# EAGLE board NN22_VCCS_SrcAdapter02_s00 (EAGLE 7.7.0)
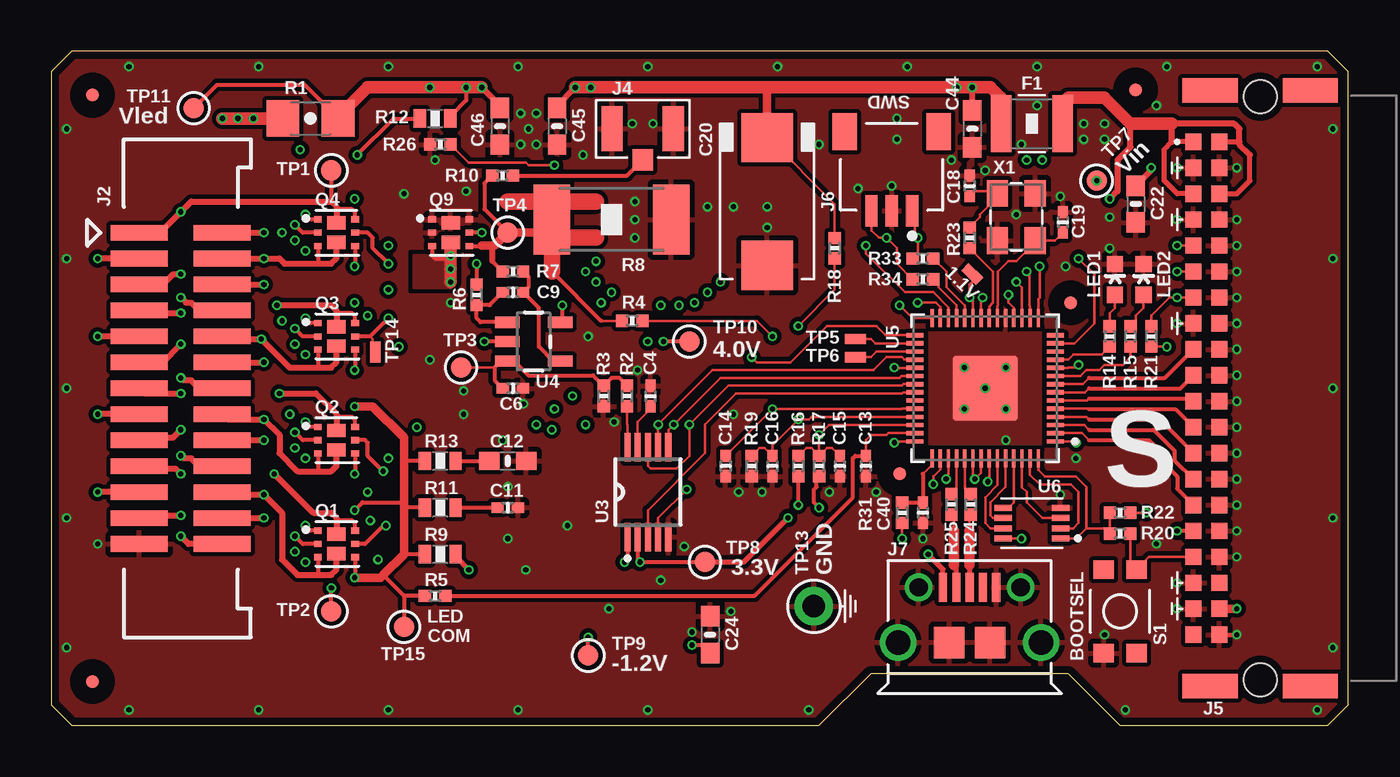
[diagram p4: board, top side]
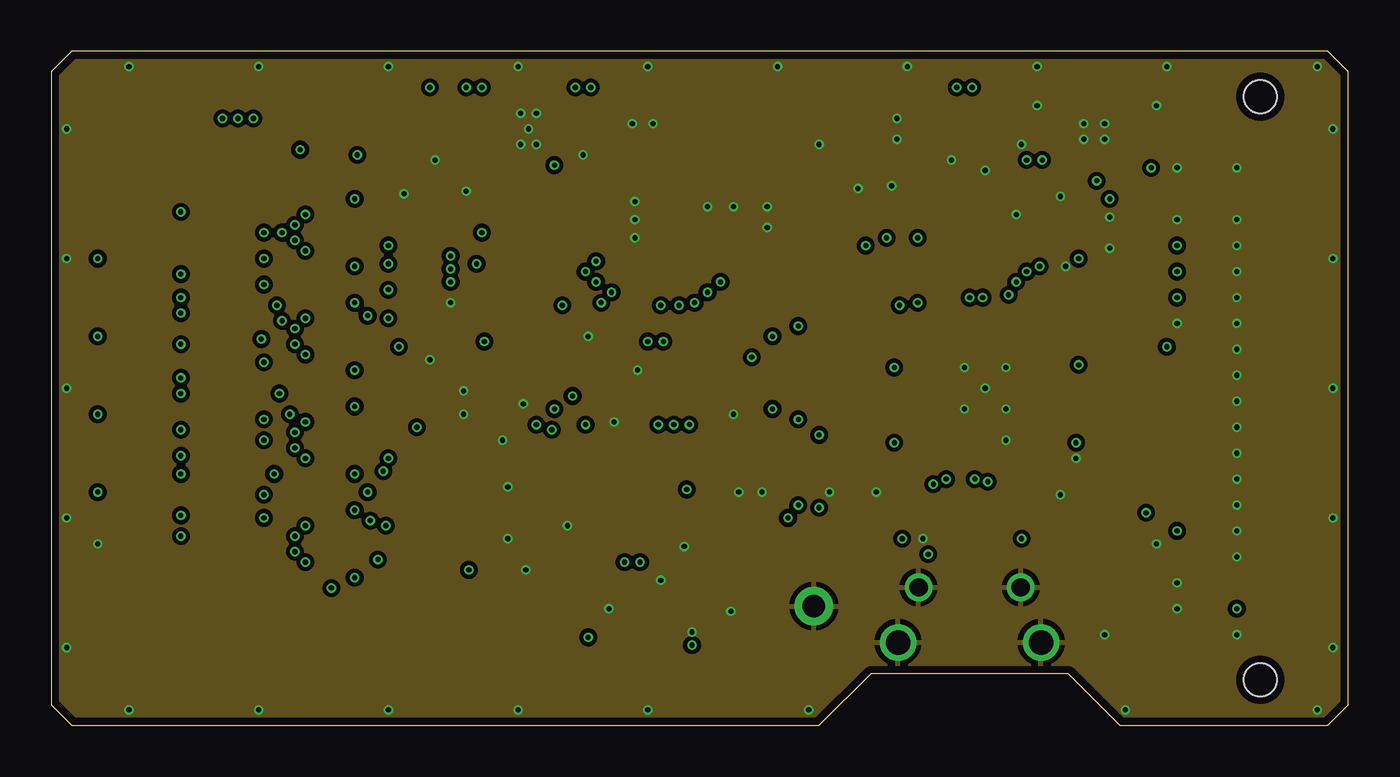
[diagram p5: board, inner layer Route2]
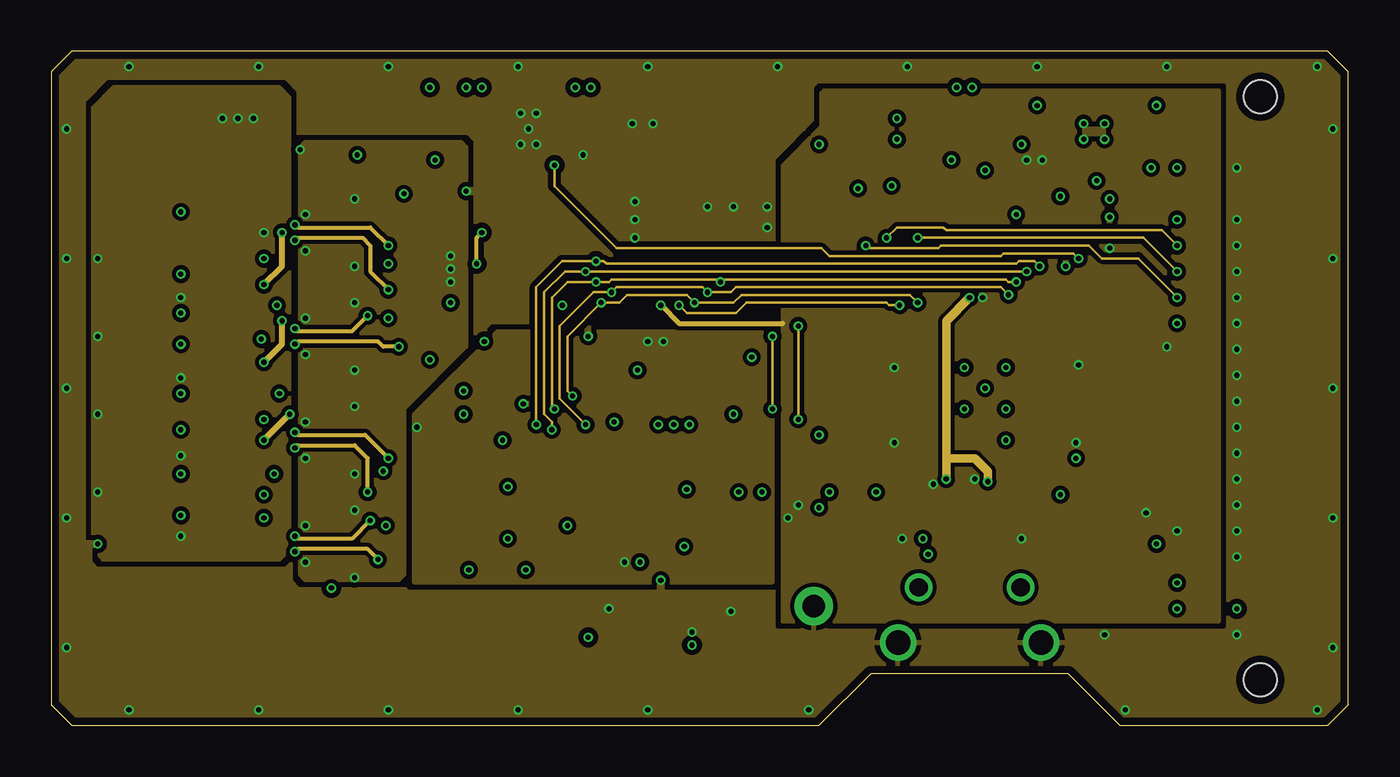
[diagram p6: board, inner layer Route15]
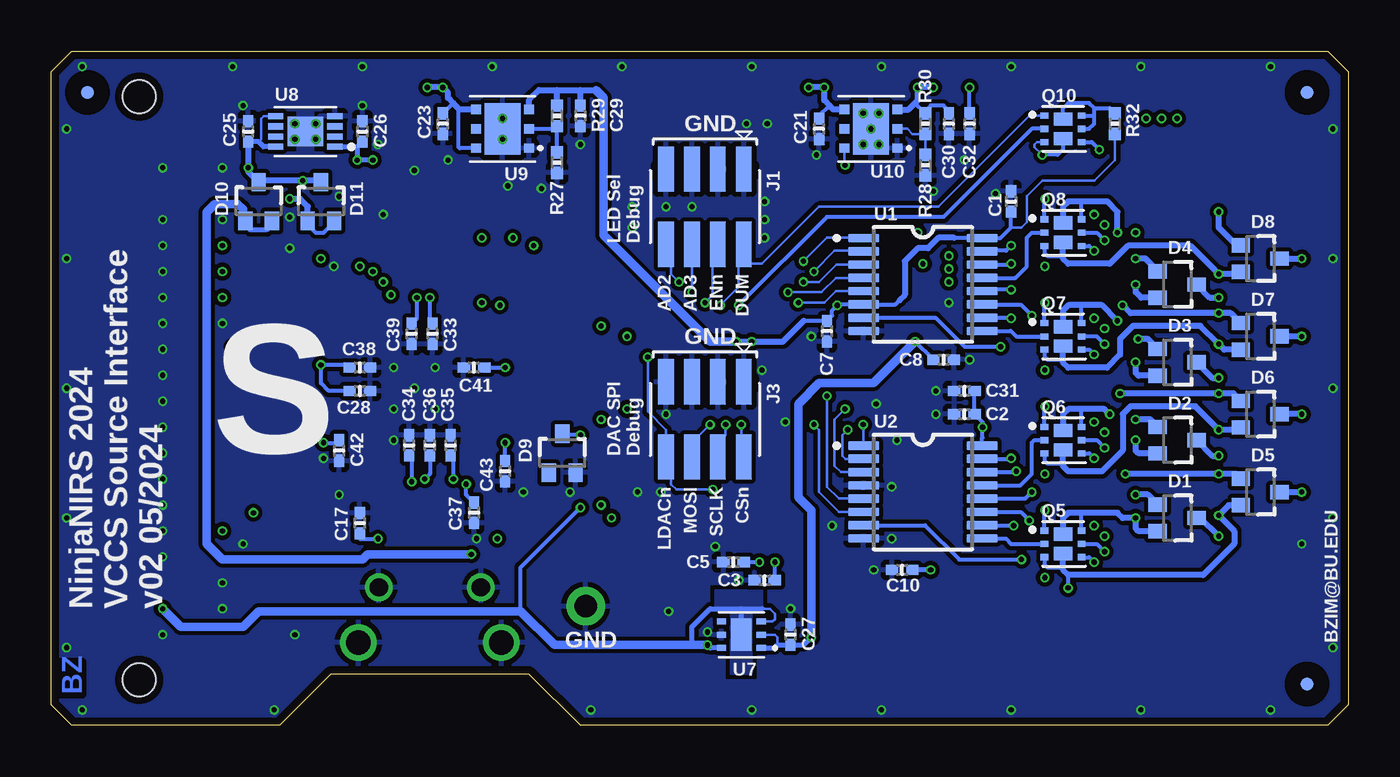
[diagram p7: board, bottom side, seen from below]

Size 63.5 x 33.02 mm. Coordinates in mm from the lower left corner, seen from the top.
Outline: 63.5,1.02 63.5,32 62.48,33.02 1.02,33.02 0,32 0,1.02 1.02,0 37.59,0 40.13,2.54 49.78,2.54 52.32,0 62.48,0 63.5,1.02
Copper layers (1*2*15*16): Top 0.035559375mm / dielectric 0.17018125mm / Route2 0.01778125mm / dielectric 47mil / Route15 0.01778125mm / dielectric 0.17018125mm / Bottom 0.035559375mm
Design rules "OSHPark-4layer *": minimum track width 5mil, minimum drill 10mil, track to track 5mil, track to pad 5mil, pad to pad 5mil, via to via 5mil, smd to smd 5mil, copper to edge 15mil, drill to drill 6mil, minimum pad ring 4mil, minimum via ring 4mil, stop-mask expansion 2mil, vias tented up to drill 12mil, thermal gap 10mil
tRestrict: area 57,24.1 to 57.3,24.2; area 57,22.8 to 57.3,22.9; area 57,21.6 to 57.3,21.6; area 57,20.3 to 57.3,20.3; area 57,19 to 57.3,19.1; area 57,17.8 to 57.3,17.8; area 57,16.5 to 57.3,16.5; area 57,15.2 to 57.3,15.3; area 57,13.9 to 57.3,14; area 57,12.7 to 57.3,12.7; area 57,11.4 to 57.3,11.5; area 57,10.1 to 57.3,10.2; 6 more areas; 1 lines
bRestrict: 9 lines

## Footprints (pad centres in the part's own frame; a part is rotated, then mirrored left to right if it is on the bottom)
0402-CAP = smd 0.6 x 0.5: 1 -0.5,0; 2 0.5,0
0603-CAP = smd 1 x 0.9: 1 -0.9,0; 2 0.9,0
2917-CAP = smd 2.4 x 2.5: N 3.125,0; P -3.125,0
SOT323 = smd 0.9 x 0.7: 1 -0.95,0.65; 2 -0.95,-0.65; 3 0.95,0
1210-FUSE = smd 1 x 2.8: 1 -1.5,0; 2 1.5,0
MICRO-FIDUCIAL = smd 0.635 x 0.635: 1 0,0
M04X2_0.050_SMD_NO_CREAM = smd 2.21 x 0.762: 1 -1.841,1.905; 2 1.841,1.905; 3 -1.841,0.635; 4 1.841,0.635; 5 -1.841,-0.635; 6 1.841,-0.635; 7 -1.841,-1.905; 8 1.841,-1.905
M13X2_0.050_SHF = smd 2.794 x 0.762: 1 -2.032,7.62; 2 2.032,7.62; 3 -2.032,6.35; 4 2.032,6.35; 5 -2.032,5.08; 6 2.032,5.08; 7 -2.032,3.81; 8 2.032,3.81; 9 -2.032,2.54; 10 2.032,2.54; 11 -2.032,1.27; 12 2.032,1.27; 13 -2.032,0; 14 2.032,0; 15 -2.032,-1.27; 16 2.032,-1.27; 17 -2.032,-2.54; 18 2.032,-2.54; 19 -2.032,-3.81; 20 2.032,-3.81; 21 -2.032,-5.08; 22 2.032,-5.08; 23 -2.032,-6.35; 24 2.032,-6.35; 25 -2.032,-7.62; 26 2.032,-7.62
U.FL = smd 2.2 x 1.05: P$1 0,1.5; P$2 0,-1.5 | smd 1.05 x 1: P$3 1.525,0
M20X2_HARFLEX_M = smd 0.8 x 0.8: A1 12.065,2; A2 10.795,2; A3 9.525,2; A4 8.255,2; A5 6.985,2; A6 5.715,2; A7 4.445,2; A8 3.175,2; A9 1.905,2; A10 0.635,2; A11 -0.635,2; A12 -1.905,2; A13 -3.175,2; A14 -4.445,2; A15 -5.715,2; A16 -6.985,2; A17 -8.255,2; A18 -9.525,2; A19 -10.795,2; A20 -12.065,2; B1 12.065,3.27; B2 10.795,3.27; B3 9.525,3.27; B4 8.255,3.27; B5 6.985,3.27; B6 5.715,3.27; B7 4.445,3.27; B8 3.175,3.27; B9 1.905,3.27; B10 0.635,3.27; B11 -0.635,3.27; B12 -1.905,3.27; B13 -3.175,3.27; B14 -4.445,3.27; B15 -5.715,3.27; B16 -6.985,3.27; B17 -8.255,3.27; B18 -9.525,3.27; B19 -10.795,3.27; B20 -12.065,3.27 | smd 1.2 x 2.7: P$17 -14.575,2.45; P$18 -14.575,-2.45; P$19 14.575,2.45; P$20 14.575,-2.45 | hole 1.6: -14.275,0; 14.275,0
M03X1_JST_SH_SM_RA = smd 0.6 x 1.55: 1 -1,4.775; 2 0,4.775; 3 1,4.775 | smd 1.2 x 1.8: PAD1 -2.3,0.9; PAD2 2.3,0.9
USB-MICRO = smd 0.4 x 1.4: 1 -1.3,2.7; 2 -0.65,2.7; 3 0,2.7; 4 0.65,2.7; 5 1.3,2.7 | drill 0.9: SH1 -2.5,2.7; SH2 2.5,2.7 | drill 1.2: SH3 -3.5,0; SH6 3.5,0 | smd 1.5 x 1.55: SH4 -1,0; SH5 1,0
LED-0603 = smd 0.8 x 0.8: A 0,-0.75; C 0,0.75
UDFN8 = smd 0.375 x 0.3: 1 -0.91,0.65; 2 -0.91,0; 3 -0.91,-0.65; 4 0.91,-0.65; 5 0.91,0; 6 0.91,0.65 | smd 0.9 x 0.65: P1 0,0.475; P2 0,-0.475
1206 = smd 1.6 x 1.8: 1 -1.35,0; 2 1.35,0
0402-RES = smd 0.6 x 0.6: 1 -0.5,0; 2 0.5,0
R2512 = smd 1.778 x 3.429: 1 -2.921,0; 2 2.921,0
0603-RES = smd 0.6 x 0.9: 1 -0.75,0; 2 0.75,0
TACTILE_SWITCH_SMD-3 = smd 0.9 x 1: 1 -2.05,0.8; 2 2.05,0.8; 3 -2.05,-0.8; 4 2.05,-0.8
TESTPAD_ROUND = smd 1.016 x 1.016: P$1 0,0
TESTPAD_SMALL = smd 1.016 x 0.508: P$1 0,0
1X01 = drill 1.1 pad 1.88: 1 0,0
TSSOP16 = smd 1.5 x 0.42: 1 -2.9,2.275; 2 -2.9,1.625; 3 -2.9,0.975; 4 -2.9,0.325; 5 -2.9,-0.325; 6 -2.9,-0.975; 7 -2.9,-1.625; 8 -2.9,-2.275; 9 2.9,-2.275; 10 2.9,-1.625; 11 2.9,-0.975; 12 2.9,-0.325; 13 2.9,0.325; 14 2.9,0.975; 15 2.9,1.625; 16 2.9,2.275
MSOP10 = smd 1.4 x 0.3: 1 -2.2,1; 2 -2.2,0.5; 3 -2.2,0; 4 -2.2,-0.5; 5 -2.2,-1; 6 2.2,-1; 7 2.2,-0.5; 8 2.2,0; 9 2.2,0.5; 10 2.2,1
SOT23-5 = smd 1.2 x 0.55: 1 -1.3,0.95; 2 -1.3,0; 3 -1.3,-0.95; 4 1.3,-0.95; 5 1.3,0.95
QFN-56_EP = smd 0.875 x 0.2: 1 -3.438,2.6; 2 -3.438,2.2; 3 -3.438,1.8; 4 -3.438,1.4; 5 -3.438,1; 6 -3.438,0.6; 7 -3.438,0.2; 8 -3.438,-0.2; 9 -3.438,-0.6; 10 -3.438,-1; 11 -3.438,-1.4; 12 -3.438,-1.8; 13 -3.438,-2.2; 14 -3.438,-2.6; 29 3.438,-2.6; 30 3.438,-2.2; 31 3.438,-1.8; 32 3.438,-1.4; 33 3.438,-1; 34 3.438,-0.6; 35 3.438,-0.2; 36 3.438,0.2; 37 3.438,0.6; 38 3.438,1; 39 3.438,1.4; 40 3.438,1.8; 41 3.438,2.2; 42 3.438,2.6 | smd 0.2 x 0.875: 15 -2.6,-3.438; 16 -2.2,-3.438; 17 -1.8,-3.438; 18 -1.4,-3.438; 19 -1,-3.438; 20 -0.6,-3.438; 21 -0.2,-3.438; 22 0.2,-3.438; 23 0.6,-3.438; 24 1,-3.438; 25 1.4,-3.438; 26 1.8,-3.438; 27 2.2,-3.438; 28 2.6,-3.438; 43 2.6,3.438; 44 2.2,3.438; 45 1.8,3.438; 46 1.4,3.438; 47 1,3.438; 48 0.6,3.438; 49 0.2,3.438; 50 -0.2,3.438; 51 -0.6,3.438; 52 -1,3.438; 53 -1.4,3.438; 54 -1.8,3.438; 55 -2.2,3.438; 56 -2.6,3.438 | smd 3.2 x 3.2: PAD 0,0
USON8L-2X3MM = smd 0.85 x 0.3: 1 -1.4,0.75; 2 -1.4,0.25; 3 -1.4,-0.25; 4 -1.4,-0.75; 5 1.4,-0.75; 6 1.4,-0.25; 7 1.4,0.25; 8 1.4,0.75
WSON6 = smd 0.45 x 0.3: 1 -0.975,0.65; 2 -0.975,0; 3 -0.975,-0.65; 4 0.975,-0.65; 5 0.975,0; 6 0.975,0.65 | smd 1 x 1.6: PAD 0,0
DFN8_2X3MM = smd 0.75 x 0.3: 1 -1.45,0.75; 2 -1.45,0.25; 3 -1.45,-0.25; 4 -1.45,-0.75; 5 1.45,-0.75; 6 1.45,-0.25; 7 1.45,0.25; 8 1.45,0.75 | smd 1.75 x 1.45: P 0,0
DFN6_3X3MM = smd 0.5 x 0.45: 1 -1.3,0.95; 2 -1.3,0; 3 -1.3,-0.95; 4 1.3,-0.95; 5 1.3,0; 6 1.3,0.95 | smd 1.75 x 2.5: PAD 0,0
CRYSTAL-3.2-2.5 = smd 1.3 x 1.05: 1 -1.15,-0.925; 2 1.15,-0.925; 3 1.15,0.925; 4 -1.15,0.925

## Placement (x,y rotation side)
C1  0.1u  [0402-CAP]  16.51,25.65 90 bottom
C2  0.1u  [0402-CAP]  18.8,15.24 180 bottom
C3  0.1u  [0402-CAP]  28.57,7.11 180 bottom
C4  10n  [0402-CAP]  29.34,16.13 90 top
C5  0.1u  [0402-CAP]  30.1,8 180 bottom
C6  100p  [0402-CAP]  22.61,16.51 0 top
C7  0.1u  [0402-CAP]  25.53,19.3 270 bottom
C8  0.1u  [0402-CAP]  19.81,17.91 0 bottom
C9  100p  [0402-CAP]  22.61,21.21 0 top
C10  0.1u  [0402-CAP]  21.84,7.62 180 bottom
C11  10n  [0402-CAP]  22.35,10.67 0 top
C12  DNP  [0603-CAP]  22.35,12.95 0 top
C13  100p  [0402-CAP]  39.88,12.7 270 top
C14  100p  [0402-CAP]  33.02,12.7 270 top
C15  100p  [0402-CAP]  38.61,12.7 270 top
C16  100p  [0402-CAP]  35.31,12.7 270 top
C17  0.1u  [0402-CAP]  48.39,9.91 90 bottom
C18  27p  [0402-CAP]  44.96,26.42 90 top
C19  27p  [0402-CAP]  49.53,24.64 90 top
C20  150u  [2917-CAP]  35.05,25.65 270 top
C21  0.1u  [0402-CAP]  25.91,29.21 270 bottom
C22  10u  [0603-CAP]  53.09,25.53 270 top
C23  0.1u  [0402-CAP]  44.32,29.46 270 bottom
C24  10u  [0603-CAP]  32.26,4.45 270 top
C25  0.1u  [0402-CAP]  53.85,29.08 90 bottom
C26  4.7u  [0402-CAP]  48.26,29.08 90 bottom
C27  4.7u  [0402-CAP]  27.3,4.45 270 bottom
C28  4.7u  [0402-CAP]  48.39,16.38 0 bottom
C29  4.7u  [0402-CAP]  37.59,29.84 270 bottom
C30  0.1u  [0402-CAP]  19.56,29.46 270 bottom
C31  4.7u  [0402-CAP]  18.8,16.38 180 bottom
C32  DNP  [0402-CAP]  18.54,29.46 270 bottom
C33  0.1u  [0402-CAP]  44.83,19.18 270 bottom
C34  0.1u  [0402-CAP]  45.97,13.72 90 bottom
C35  4.7u  [0402-CAP]  43.94,13.72 90 bottom
C36  0.1u  [0402-CAP]  44.96,13.72 90 bottom
C37  4.7u  [0402-CAP]  42.8,10.41 270 bottom
C38  0.1u  [0402-CAP]  48.39,17.53 0 bottom
C39  0.1u  [0402-CAP]  45.85,19.18 270 bottom
C40  4.7u  [0402-CAP]  42.67,10.41 270 top
C41  0.1u  [0402-CAP]  42.8,17.53 180 bottom
C42  0.1u  [0402-CAP]  49.4,13.46 270 bottom
C43  0.1u  [0402-CAP]  41.27,12.45 270 bottom
C44  10u  [0603-CAP]  45.09,29.21 270 top
C45  10u  [0603-CAP]  24.77,29.34 270 top
C46  10u  [0603-CAP]  21.97,29.34 270 top
D1  BAV70W  [SOT323]  8.38,10.16 0 bottom
D2  BAV70W  [SOT323]  8.38,13.97 0 bottom
D3  BAV70W  [SOT323]  8.38,17.78 0 bottom
D4  BAV70W  [SOT323]  8.38,21.59 0 bottom
D5  BAV70W  [SOT323]  4.32,11.43 0 bottom
D6  BAV70W  [SOT323]  4.32,15.24 0 bottom
D7  BAV70W  [SOT323]  4.32,19.05 0 bottom
D8  BAV70W  [SOT323]  4.32,22.86 0 bottom
D9  BAV70W  [SOT323]  38.48,13.34 90 bottom
D10  BAV70W  [SOT323]  53.34,25.65 90 bottom
D11  BAV70W  [SOT323]  50.29,25.65 90 bottom
F1  0ZCH0035FF2G  [1210-FUSE]  48.01,29.46 0 top
FID1  FIDUCIALUFIDUCIAL  [MICRO-FIDUCIAL]  2.03,30.86 0 top
FID2  FIDUCIALUFIDUCIAL  [MICRO-FIDUCIAL]  49.91,20.7 0 top
FID3  FIDUCIALUFIDUCIAL  [MICRO-FIDUCIAL]  2.03,2.16 0 top
FID4  FIDUCIALUFIDUCIAL  [MICRO-FIDUCIAL]  41.53,12.32 0 top
FID5  FIDUCIALUFIDUCIAL  [MICRO-FIDUCIAL]  53.09,31.11 0 top
FID6  FIDUCIALUFIDUCIAL  [MICRO-FIDUCIAL]  2.03,30.99 0 bottom
FID7  FIDUCIALUFIDUCIAL  [MICRO-FIDUCIAL]  2.03,2.03 0 bottom
FID8  FIDUCIALUFIDUCIAL  [MICRO-FIDUCIAL]  61.72,30.99 0 bottom
J1  M04X2_0.050_SMD_NO_CREAM  [M04X2_0.050_SMD_NO_CREAM]  31.5,25.4 270 bottom
J2  M13X2_0.050_SHF  [M13X2_0.050_SHF]  6.35,16.51 0 top
J3  M04X2_0.050_SMD_NO_CREAM  [M04X2_0.050_SMD_NO_CREAM]  31.5,14.99 270 bottom
J4  U.FL  [U.FL]  28.96,29.21 270 top
J5  M20X2_HARFLEX_M  [M20X2_HARFLEX_M]  59.18,16.51 90 top
J6  M03X1_JST_SH_RA  [M03X1_JST_SH_SM_RA]  41.15,29.97 180 top
J7  USB-MICRO  [USB-MICRO]  44.96,4.06 0 top
LED1  [LED-0603]  52.07,21.84 0 top
LED2  [LED-0603]  53.47,21.84 0 top
Q1  MOSFET-DUAL-N-UDFN8  [UDFN8]  13.97,8.89 0 top
Q2  MOSFET-DUAL-N-UDFN8  [UDFN8]  13.97,13.97 0 top
Q3  MOSFET-DUAL-N-UDFN8  [UDFN8]  13.97,19.05 0 top
Q4  MOSFET-DUAL-N-UDFN8  [UDFN8]  13.97,24.13 0 top
Q5  MOSFET-DUAL-N-UDFN8  [UDFN8]  13.97,8.89 0 bottom
Q6  MOSFET-DUAL-N-UDFN8  [UDFN8]  13.97,13.97 0 bottom
Q7  MOSFET-DUAL-N-UDFN8  [UDFN8]  13.97,19.05 0 bottom
Q8  MOSFET-DUAL-N-UDFN8  [UDFN8]  13.97,24.13 0 bottom
Q9  MOSFET-DUAL-N-UDFN8  [UDFN8]  19.56,24.13 0 top
Q10  MOSFET-DUAL-N-UDFN8  [UDFN8]  13.97,29.21 0 bottom
R1  0  [1206]  12.7,29.72 0 top
R2  10k  [0402-RES]  28.19,16.13 90 top
R3  24k  [0402-RES]  27.05,16.13 90 top
R4  10k  [0402-RES]  28.45,19.81 180 top
R5  10k  [0402-RES]  18.8,6.35 180 top
R6  100  [0402-RES]  20.83,21.08 90 top
R7  1.2k  [0402-RES]  22.61,22.23 180 top
R8  8.2  [R2512]  27.43,24.77 180 top
R9  10  [0603-RES]  19.05,8.38 180 top
R10  100  [0402-RES]  22.1,26.92 0 top
R11  1  [0603-RES]  19.05,10.67 180 top
R12  150  [0603-RES]  18.8,29.72 0 top
R13  DNP  [0603-RES]  19.05,12.95 180 top
R14  1.2k  [0402-RES]  51.82,19.05 270 top
R15  1.2k  [0402-RES]  52.83,19.05 270 top
R16  10k  [0402-RES]  36.58,12.7 270 top
R17  28k  [0402-RES]  37.59,12.7 90 top
R18  28k  [0402-RES]  38.35,23.37 90 top
R19  10k  [0402-RES]  34.29,12.7 90 top
R20  1.2k  [0402-RES]  52.32,9.4 180 top
R21  100k  [0402-RES]  53.85,19.05 270 top
R22  100k  [0402-RES]  52.32,10.41 0 top
R23  1.2k  [0402-RES]  44.96,23.88 90 top
R24  27  [0402-RES]  45.01,10.82 270 top
R25  27  [0402-RES]  44.07,10.82 270 top
R26  100k  [0402-RES]  19.05,28.45 0 top
R27  10k  [0402-RES]  38.73,27.56 90 bottom
R28  10k  [0402-RES]  20.7,27.43 90 bottom
R29  24k  [0402-RES]  38.73,29.84 90 bottom
R30  28k  [0402-RES]  20.7,29.46 90 bottom
R31  27  [0402-RES]  41.66,10.41 90 top
R32  10k  [0402-RES]  11.43,29.46 270 bottom
R33  27  [0402-RES]  42.67,22.86 180 top
R34  27  [0402-RES]  42.67,21.84 180 top
S1  SWITCH-MOMENTARY-2SMD-3  [TACTILE_SWITCH_SMD-3]  52.32,5.59 90 top
TP1  TESTPOINT_ROUND  [TESTPAD_ROUND]  13.72,27.18 0 top
TP2  TESTPOINT_ROUND  [TESTPAD_ROUND]  13.72,5.59 0 top
TP3  TESTPOINT_ROUND  [TESTPAD_ROUND]  20.07,17.53 0 top
TP4  TESTPOINT_ROUND  [TESTPAD_ROUND]  22.35,24.13 0 top
TP5  TESTPOINTPADSMALL  [TESTPAD_SMALL]  39.37,18.92 0 top
TP6  TESTPOINTPADSMALL  [TESTPAD_SMALL]  39.37,18.03 0 top
TP7  TESTPOINT_ROUND  [TESTPAD_ROUND]  51.18,26.67 90 top
TP8  TESTPOINT_ROUND  [TESTPAD_ROUND]  32,8 0 top
TP9  TESTPOINT_ROUND  [TESTPAD_ROUND]  26.29,3.43 0 top
TP10  TESTPOINT_ROUND  [TESTPAD_ROUND]  31.24,18.8 0 top
TP11  TESTPOINT_ROUND  [TESTPAD_ROUND]  6.99,30.23 0 top
TP12  TESTPOINTPADSMALL  [TESTPAD_SMALL]  45.09,22.1 135 top
TP13  TESTPOINT1X01  [1X01]  37.34,5.84 0 top
TP14  TESTPOINTPADSMALL  [TESTPAD_SMALL]  15.88,18.29 90 top
TP15  TESTPOINT_ROUND  [TESTPAD_ROUND]  17.27,4.83 0 top
U1  74HC238_TSSOP  [TSSOP16]  20.83,21.59 0 bottom
U2  74HC238_TSSOP  [TSSOP16]  20.83,11.43 0 bottom
U3  AD5683R_MSOP  [MSOP10]  29.21,11.43 90 top
U4  OPA392_SOT23  [SOT23-5]  23.62,18.8 0 top
U5  RP2040  [QFN-56_EP]  45.72,16.51 180 top
U6  W25Q_USON  [USON8L-2X3MM]  48.01,9.91 180 top
U7  ADP7182_WSON  [WSON6]  29.72,4.45 180 bottom
U8  MCP1755_DFN  [DFN8_2X3MM]  51.05,29.08 180 bottom
U9  LDL212_DFN6_3X3  [DFN6_3X3MM]  41.4,29.21 180 bottom
U10  LDL212_DFN6_3X3  [DFN6_3X3MM]  23.37,29.21 180 bottom
X1  CRYSTAL-3.2-2.5  [CRYSTAL-3.2-2.5]  47.24,24.89 270 top

## Tracks (layer width: path | path; a pad name or v marks a point on that pad's centre or on a via)
BOOTSEL
  Top 0.127: J5.B17 53.74,8.26 S1.4 52.82,7.94 R20.1
DAC_CSN  (via drill 0.25)
  Top 0.127: U5.32 41.78,17.91 41.66,18.03 40.89,18.03 40.26,17.4 32.38,17.4 v29.72,14.73 U3.7
  Bottom 0.127: v29.72,14.73 29.72,13.27 J3.2
DAC_LDACN  (via drill 0.25)
  Top 0.127: U5.29 40.83,19.11 40.39,19.56 37.97,19.56 36.2,17.78 34.54,17.78 v34.29,18.03 | U3.4 29.71,10.15 v31.11,11.56
  Bottom 0.127: v34.29,18.03 34.29,15.37 33.4,14.48 J3.8 33.15,12.89 33.15,11.81 32.89,11.56 v31.11,11.56
DAC_MOSI  (via drill 0.25)
  Top 0.127: U5.35 41.73,16.71 41.66,16.64 33.15,16.64 v31.24,14.73 31.24,13.21 30.61,12.57 29.34,12.57 29.21,12.7 U3.8
  Bottom 0.127: v31.24,14.73 32,13.97 32,13.27 J3.6
DAC_RESETN
  Top 0.127: U5.36 41.71,16.31 41.66,16.26 33.53,16.26 32,14.73 32,13.34 29.21,10.54 U3.3
DAC_SCLK  (via drill 0.25)
  Top 0.127: U5.34 41.62,17.11 41.53,17.02 32.77,17.02 v30.48,14.73 30.23,14.48 30.23,13.65 U3.6
  Bottom 0.127: v30.48,14.73 30.48,14.22 30.61,14.1 30.61,13.4 J3.4
DUMMY_EN  (via drill 0.25)
  Top 0.127: U5.28 42.16,19.95 v41.53,20.57
  Route15 0.127: v41.53,20.57 41.02,20.57 40.89,20.7 34.04,20.7 33.53,20.19 31.11,20.19 v30.73,20.57
  Bottom 0.127: v30.73,20.57 29.84,21.46 29.84,22.61 | 29.84,22.61 29.84,23.3 J1.2 | 29.84,22.61 28.7,22.61 25.91,25.4 20.07,25.4 15.62,29.84 14.89,29.84 Q10.1
GND  (via drill 0.25)
  Top 0.203: J5.A20 v58.04,4.45
  other vias: 10.16,32.26 52.58,0.76 51.82,23.37 58.04,20.95 3.81,0.76 61.98,0.76 58.04,22.23 55.12,24.77 58.04,15.88 58.04,13.34 49.4,11.3 51.82,24.89 50.55,29.46 51.56,29.46 51.56,28.7 50.55,28.7 48.26,30.35 54.1,30.35 33.27,5.59 31.37,4.57 27.3,5.71 10.16,0.76 22.86,0.76 29.21,0.76 37.08,0.76 58.04,9.53 58.04,8.26 55.12,5.71 55.12,6.99 55.12,19.68 58.04,27.3 51.56,4.45 44.7,17.53 46.74,17.53 46.74,15.49 44.7,15.49 42.67,9.14 49.66,22.48 49.4,25.91 45.72,27.18 47.24,25.02 41.15,26.42 39.5,26.29 46.74,13.97 40.39,11.43 55.12,27.3 58.04,24.77 58.04,23.5 58.04,19.68 58.04,18.41 58.04,17.14 58.04,14.61 58.04,12.06 58.04,10.79 3.81,32.26 16.51,32.26 22.86,32.26 29.21,32.26 35.56,32.26 41.91,32.26 48.26,32.26 54.61,32.26 61.98,32.26 0.76,3.81 0.76,10.16 0.76,16.51 0.76,22.86 0.76,29.21 62.74,3.81 62.74,10.16 62.74,16.51 62.74,22.86 62.74,29.21 50.16,13.08 54.1,8.89 45.72,16.51 41.4,29.72 41.4,28.7 37.59,28.45 47.5,28.45 35.05,25.4 35.05,24.38 18.8,27.69 22.99,29.97 23.75,29.97 23.75,28.45 22.99,28.45 23.37,29.21 20.32,26.16 20.19,16.38 20.19,15.24 23.11,15.75 18.54,17.91 2.29,8.89 26.29,19.05 28.7,17.4 27.56,14.86 38.1,11.43 34.8,11.43 33.66,11.43 16.51,0.76 26.04,27.94 28.45,29.46 29.46,29.46 28.57,23.88 32.13,25.4 33.4,25.4 22.1,13.97 22.35,11.68 22.35,9.14 17.27,26.04 29.84,7.11 30.99,8.76 33.4,15.24 28.57,25.65 19.56,20.7 23.24,7.62 25.27,9.78 28.57,24.77 44.07,27.69
  pour Route2 (isolate 0.203, rank 6): 0,0 63.5,0 63.5,33.02 0,33.02
  pour Route15 (isolate 0.254, rank 6): 0,0 63.5,0 63.5,33.02 0,33.02
  pour Top (isolate 0.203, rank 6): 0,33.02 63.5,33.02 63.5,0 0,0
  pour Bottom (isolate 0.203, rank 6): 0,33.02 63.5,33.02 63.5,0 0,0
  pour Bottom (isolate 0.203, no thermals): 50.67,30.23 50.67,27.94 51.44,27.94 51.44,30.23
  pour Top (isolate 0.203, no thermals): 43.18,19.05 48.26,19.05 48.26,13.97 43.18,13.97
GPIO00
  Top 0.127: U5.2 50.46,14.31 50.8,13.97
  Top 0.203: 50.8,13.97 53.72,13.97 54.48,13.21 54.48,12.83 55.12,12.19 55.12,11.59 J5.B15
GPIO01
  Top 0.127: U5.3 50.57,14.71 50.8,14.48
  Top 0.203: 50.8,14.48 53.98,14.48 54.99,13.46 54.99,12.99 J5.B14
GPIO02
  Top 0.127: U5.4 50.68,15.11 50.8,14.99
  Top 0.203: 50.8,14.99 54.26,14.99 J5.B13
GPIO03
  Top 0.127: U5.5 50.78,15.51 50.8,15.49
  Top 0.203: 50.8,15.49 55.02,15.49 J5.B12
GPIO04
  Top 0.127: U5.6 50.71,15.91 50.8,16
  Top 0.203: 50.8,16 55.78,16 J5.B11
GPIO05
  Top 0.127: U5.7 50.6,16.31 50.8,16.51
  Top 0.203: 50.8,16.51 55.28,16.51 J5.B10
GPIO06
  Top 0.127: U5.8 50.49,16.71 50.8,17.02
  Top 0.203: 50.8,17.02 54.52,17.02 J5.B9
LED0
  Top 0.127: U5.11 49.79,17.91 50.04,18.16 51.44,18.16 R14.2
LED1
  Top 0.127: U5.9 50.38,17.11 50.67,17.4 51.31,17.4 51.56,17.65 52.45,17.65 52.83,18.03 R15.2
LED_0A  (via drill 0.25)
  Top 0.203: Q4.6 14.88,25.12 14.73,25.27 13.97,25.27 | TP1.P$1 13.72,25.65
  Top 0.305: J2.1 5.33,24.13 v6.35,25.15 6.86,25.65 13.72,25.65 13.97,25.4 13.97,25.27 Q4.P1
  Bottom 0.305: D8.1 5.48,23.51 6.35,24.38 v6.35,25.15
LED_0B  (via drill 0.25)
  Top 0.203: Q4.3 13.06,22.63 13.08,22.61
  Top 0.305: J2.4 v10.41,22.86 11.18,22.86 11.43,22.61 13.08,22.61 13.72,22.61 13.97,22.86 Q4.P2
  Bottom 0.305: D4.1 9.95,22.86 v10.41,22.86
LED_1A  (via drill 0.25)
  Top 0.305: J2.6 v10.41,21.59
  Route15 0.305: v10.41,21.59 11.3,22.48 v11.3,24.13
  Bottom 0.203: Q8.6 13.06,25.63 13.08,25.65
  Bottom 0.305: v11.3,24.13 11.3,25.15 11.81,25.65 13.08,25.65 13.72,25.65 13.97,25.4 Q8.P1 | D4.2 10.14,20.94 10.41,21.21 v10.41,21.59
LED_1B  (via drill 0.25)
  Top 0.305: J2.5 5.46,21.59 5.97,22.1 v6.35,22.1
  Bottom 0.203: Q8.3 14.88,23.14 14.73,22.99 13.97,22.99
  Bottom 0.305: Q8.P2 13.97,22.99 13.97,22.86 13.72,22.61 11.68,22.61 10.79,23.5 7.75,23.5 v6.35,22.1 5.38,22.1 D8.2
LED_2A  (via drill 0.25)
  Top 0.203: Q3.6 14.88,20.05 14.73,20.19 13.97,20.19
  Top 0.305: J2.7 4.45,20.19 v6.35,20.19 | v11.05,20.57 13.72,20.57 13.97,20.32 13.97,20.19 Q3.P1
  Bottom 0.305: v11.05,20.57 10.67,20.19 v6.35,20.19 5.76,20.19 D7.1
LED_2B  (via drill 0.25)
  Top 0.203: Q3.3 13.06,17.55 13.08,17.53
  Top 0.305: Q3.P2 13.97,17.78 13.72,17.53 13.08,17.53 11.68,17.53 v10.29,18.92 8.51,18.92 J2.10
  Bottom 0.305: D3.1 9.82,18.92 v10.29,18.92
LED_3A  (via drill 0.25)
  Top 0.305: J2.12 v10.41,17.78
  Route15 0.305: v10.41,17.78 11.3,18.67 v11.3,19.81
  Bottom 0.203: Q7.6 13.06,20.55 13.08,20.57
  Bottom 0.305: v11.3,19.81 12.06,20.57 13.08,20.57 13.72,20.57 13.97,20.32 Q7.P1 | D3.2 10.27,17.13 10.41,17.27 v10.41,17.78
LED_3B  (via drill 0.25)
  Top 0.305: J2.11 5.46,17.78 v6.35,18.67
  Bottom 0.203: Q7.3 14.88,18.05 14.73,17.91 13.97,17.91
  Bottom 0.305: Q7.P2 13.97,17.91 13.97,17.78 13.72,17.53 11.81,17.53 11.18,18.16 11.18,18.92 10.54,19.56 7.24,19.56 v6.35,18.67 6.08,18.4 D7.2
LED_4A  (via drill 0.25)
  Top 0.203: Q2.6 14.88,14.96 14.73,15.11 13.97,15.11
  Top 0.305: v11.18,16.26 12.95,16.26 13.97,15.24 13.97,15.11 Q2.P1 | J2.13 4.57,16.26 v6.35,16.26
  Bottom 0.305: v11.18,16.26 v6.35,16.26 5.63,16.26 D6.1
LED_4B  (via drill 0.25)
  Top 0.203: Q2.3 13.06,12.47 13.08,12.45
  Top 0.305: Q2.P2 13.97,12.7 13.72,12.45 13.08,12.45 12.06,12.45 11.18,13.34 11.18,14.22 v10.41,14.99 8.64,14.99 J2.16
  Bottom 0.305: D2.1 9.7,14.99 v10.41,14.99
LED_5A  (via drill 0.25)
  Top 0.305: J2.18 v10.41,13.97
  Route15 0.305: v10.41,13.97 v11.68,15.24
  Bottom 0.203: Q6.6 13.06,15.47 13.08,15.49
  Bottom 0.305: v11.68,15.24 11.94,15.49 13.08,15.49 13.72,15.49 13.97,15.24 Q6.P1 | D2.2 10.27,13.32 10.41,13.46 v10.41,13.97
LED_5B  (via drill 0.25)
  Top 0.305: J2.17 4.45,14.1 5.97,14.1 v6.35,14.48
  Bottom 0.203: Q6.3 14.88,12.97 14.73,12.83 13.97,12.83
  Bottom 0.305: Q6.P2 13.97,12.83 13.97,12.7 13.72,12.45 12.06,12.45 11.05,13.46 11.05,15.24 10.67,15.62 7.49,15.62 v6.35,14.48 5.38,14.48 D6.2
LED_6A  (via drill 0.25)
  Top 0.203: Q1.6 14.88,9.88 14.73,10.03 13.97,10.03
  Top 0.305: J2.19 4.45,12.57 6.1,12.57 v6.35,12.32 | v10.92,12.32 12.83,10.41 13.72,10.41 13.97,10.16 13.97,10.03 Q1.P1
  Bottom 0.305: v10.92,12.32 v6.35,12.32 5.51,12.32 D5.1
LED_6B  (via drill 0.25)
  Top 0.203: Q1.3 13.06,7.39 13.08,7.37
  Top 0.305: J2.22 8.51,11.3 v10.41,11.3 11.3,10.41 11.3,8.13 12.06,7.37 13.08,7.37 13.72,7.37 13.97,7.62 Q1.P2
  Bottom 0.305: D1.1 9.82,11.3 v10.41,11.3
LED_7A  (via drill 0.25)
  Top 0.305: J2.24 v10.41,10.16
  Bottom 0.203: Q5.6 13.06,10.39 13.08,10.41
  Bottom 0.305: Q5.P1 13.97,10.16 13.72,10.41 13.08,10.41 11.3,10.41 11.05,10.16 v10.41,10.16 10.41,9.65 10.27,9.51 D1.2
LED_7B  (via drill 0.25)
  Top 0.203: TP2.P$1 v13.72,6.73
  Top 0.305: J2.23 4.45,10.29 v6.35,10.29
  Bottom 0.203: Q5.3 14.88,7.89 14.73,7.75 13.97,7.75 | v13.72,6.73 13.72,7.37
  Bottom 0.305: Q5.P2 13.97,7.75 13.97,7.62 13.72,7.37 7.11,7.37 5.59,8.89 5.59,9.53 v6.35,10.29 5.86,10.78 D5.2
LED_A  (via drill 0.25)
  Top 0.305: J2.2 v10.41,24.13 | J2.3 v2.29,22.86 | J2.9 v2.29,19.05 | J2.15 v2.29,15.24 | J2.21 v2.29,11.43 | J2.8 7.24,20.32 6.86,20.7 6.6,20.7 v6.35,20.95 | J2.14 7.24,16.51 6.86,16.89 6.48,16.89 v6.35,17.02 | J2.20 7.24,12.7 6.86,13.08 6.48,13.08 v6.35,13.21 | J2.26 6.73,8.89 v6.35,9.27
  Top 0.61: R1.1 v9.91,29.72 v9.14,29.72 v8.38,29.72
  Bottom 0.305: D4.3 6.8,20.95 v6.35,20.95 | D8.3 v2.29,22.86 | v2.29,19.05 D7.3 | v2.29,15.24 D6.3 | D5.3 v2.29,11.43 | v6.35,9.27 7.24,10.16 D1.3 | D2.3 6.67,13.21 v6.35,13.21 | D3.3 6.67,17.02 v6.35,17.02
  pour Route15 (isolate 0.203): 11.68,30.73 11.18,31.24 3.05,31.24 2.03,30.23 2.03,8.64 2.54,8.13 11.18,8.13 11.68,8.64
LED_AD[0]  (via drill 0.25)
  Top 0.127: U5.15 48.32,20.89 48.39,20.95 v48.39,22.48
  Route15 0.127: v23.75,14.73 23.75,21.46 25.02,22.73 v26.67,22.73 27.05,22.73 27.18,22.61 47.24,22.61 47.37,22.73 48.13,22.73 v48.39,22.48
  Bottom 0.127: U1.1 23.74,23.88 25.53,23.88 v26.67,22.73 | U2.1 23.73,14.71 v23.75,14.73
LED_AD[1]  (via drill 0.25)
  Top 0.127: U5.16 47.92,20.53 47.88,20.57 47.88,22.1 v47.75,22.23
  Route15 0.127: v47.75,22.23 v26.16,22.23 25.15,22.23 24.13,21.21 24.13,15.24 24.51,14.86 v24.51,14.48
  Bottom 0.127: v26.16,22.23 25.15,23.24 23.75,23.24 U1.2 | U2.2 24.61,13.05 24.77,13.21 24.77,14.22 v24.51,14.48
LED_AD[2]  (via drill 0.25)
  Top 0.127: U5.17 47.52,21.44 v47.24,21.72
  Route15 0.127: v47.24,21.72 46.86,21.72 46.74,21.84 32.89,21.84 v32.77,21.72 32.64,21.84 27.43,21.84 27.3,21.72 v26.67,21.72 25.27,21.72 24.51,20.95 24.51,15.62 v24.64,15.49
  Bottom 0.127: v26.67,21.72 25.91,21.72 25.06,22.57 U1.3 | U2.3 24.85,12.4 25.15,12.7 25.15,14.99 v24.64,15.49 | J1.8 33.4,22.86 33.15,22.61 33.15,22.1 v32.77,21.72
LED_AD[3]  (via drill 0.25)
  Top 0.127: U5.18 47.12,20.44 46.86,20.7 v46.86,21.08
  Route15 0.127: v46.86,21.08 46.48,21.46 33.53,21.46 33.27,21.21 v32.13,21.21 31.88,21.46 27.69,21.46 v27.43,21.21 26.54,21.21 24.89,19.56 24.89,16 v26.16,14.73
  Bottom 0.127: v27.43,21.21 25.78,21.21 25.07,21.91 U1.4 | U2.6 24.93,10.46 25.91,11.43 25.91,14.48 v26.16,14.73 | J1.6 v32.13,21.21
LED_COM  (via drill 0.25)
  Top 0.203: Q9.3 18.65,23.01 18.8,22.86 19.43,22.86 v19.56,22.99 | Q3.4 14.88,17.42 v14.86,17.4 | Q2.4 14.88,12.34 v14.86,12.32 | Q1.4 14.88,7.26 v14.86,7.24 | Q1.1 12.69,9.54 v12.45,9.78 | Q2.1 12.69,14.62 v12.45,14.86 | Q3.1 12.69,19.7 v12.45,19.94 | Q4.1 12.69,24.78 v12.45,25.02 | Q4.4 14.88,22.5 v14.86,22.48 | v14.86,10.54 15.24,10.92 17.27,10.92 | R13.2 17.27,12.95 | R5.2 17.27,6.35 | 17.27,6.35 16.26,7.37 | R11.2 17.27,10.67 | R9.2 17.27,8.38 | 17.27,6.35 TP15.P$1
  Top 0.406: v14.86,15.62 15.75,15.62 17.27,14.1 17.27,12.95 17.27,10.92 17.27,10.67 17.27,8.38 16.26,7.37 16.13,7.24 v14.86,7.24
  Top 0.61: Q9.P2 v19.56,22.99 v19.56,22.35 v19.56,21.72
  Bottom 0.203: Q8.1 14.88,25.76 v14.86,25.78 | Q8.4 12.69,23.48 v12.45,23.24 | Q7.4 12.69,18.4 v12.45,18.16 | Q7.1 14.88,20.68 v14.86,20.7 | Q6.1 14.88,15.6 v14.86,15.62 | Q6.4 12.69,13.32 v12.45,13.08 | Q5.1 14.88,10.52 v14.86,10.54 | Q5.4 12.69,8.24 v12.45,8 | Q10.4 12.56,28.56 v12.19,28.19
  pour Route15 (isolate 0.203): 12.19,28.32 12.45,28.57 20.07,28.57 20.32,28.32 20.32,18.54 17.27,15.49 17.27,7.37 17.02,7.11 12.45,7.11 12.19,7.37
  pour Top: 19.56,22.86 18.67,22.86 18.67,22.99 17.78,22.99 17.78,21.46 19.56,21.46
LED_COM_SENSE
  Top 0.127: U5.41 40.98,14.31 40.89,14.22 40.13,14.22 39.88,13.97 C13.1
  Top 0.203: R5.1 34.42,6.35 39.24,11.18 39.24,13.08 39.37,13.21 C13.1
LED_CURR_SENSE  (via drill 0.25)
  Top 0.127: R4.1 34.54,19.81 v35.31,19.05 | U5.38 41.67,15.51 41.66,15.49 v35.31,15.49 C14.1
  Route15 0.127: v35.31,19.05 v35.31,15.49
LED_ENN  (via drill 0.25)
  Top 0.127: U5.27 43.52,20.49 43.31,20.7 v42.42,20.7
  Route15 0.127: v42.42,20.7 42.04,21.08 33.78,21.08 33.4,20.7 v31.5,20.7 31.11,21.08 28.19,21.08 27.81,20.7 v26.92,20.7 25.27,19.05 25.27,16.38 v25.53,16.13
  Bottom 0.127: v26.92,20.7 25.65,20.7 25.09,21.27 U1.5 | U2.5 24.95,11.11 25.53,11.68 v25.53,16.13 | J1.4 30.86,22.86 31.11,22.61 31.11,21.08 v31.5,20.7
N$1  (via drill 0.25)
  Top 0.203: v21.08,24.13 Q9.5 | v20.83,22.61 R6.2
  Route15 0.203: v20.83,22.61 20.83,23.88 v21.08,24.13
N$2
  Top 0.127: U3.10 28.21,14.72 28.19,14.73 R2.1
N$3  (via drill 0.25)
  Top 0.203: v16.51,22.61 15.75,23.37 15.75,23.88 15.49,24.13 Q4.5
  Bottom 0.203: U1.14 16.55,22.57 v16.51,22.61
N$4  (via drill 0.25)
  Top 0.127: TP14.P$1 15.88,18.41 15.75,18.54 15.75,18.92 15.62,19.05
  Top 0.203: v16.51,19.94 15.62,19.05 Q3.5
  Bottom 0.203: U1.10 16.54,19.96 v16.51,19.94
N$5  (via drill 0.25)
  Route15 0.203: v11.94,23.75 12.06,23.88 15.24,23.88 15.62,23.5 15.62,22.23 v16.51,21.34
  Bottom 0.203: Q8.5 12.32,24.13 v11.94,23.75 | v16.51,21.34 17.86,21.34 U1.12
N$6
  Bottom 0.203: U1.13 16.31,21.91 15.75,22.48 15.75,23.88 15.49,24.13 Q8.2
N$7  (via drill 0.25)
  Top 0.203: v14.99,27.94 16.76,29.72 R12.1
  Bottom 0.127: v14.99,27.94 15.37,28.32 15.37,28.45 15.26,28.56 Q10.3
  Bottom 0.203: Q10.P2 13.97,28.19 14.22,27.94 v14.99,27.94
N$8  (via drill 0.25)
  Route15 0.203: v17.02,18.54 16.26,18.54 16,18.8 12.06,18.8 v11.94,18.67
  Bottom 0.203: U1.7 20.22,19.96 18.8,18.54 v17.02,18.54 | v11.94,18.67 12.32,19.05 Q7.5
N$9
  Bottom 0.203: U1.9 16.52,19.32 16.26,19.05 Q7.2
N$10
  Top 0.127: 21.72,17.53 TP3.P$1
  Top 0.203: R2.2 27.81,17.02 27.44,17.02 R3.2 26.54,17.14 23.37,17.14 22.67,17.85 U4.3 22.04,17.85 21.72,17.53 21.72,16.9 C6.1
N$11  (via drill 0.25)
  Top 0.203: v16.26,12.45 15.49,13.21 15.49,13.84 15.37,13.97 Q2.5
  Bottom 0.203: U2.14 16.3,12.4 v16.26,12.45
N$12  (via drill 0.25)
  Route15 0.203: v11.94,13.59 12.06,13.72 14.86,13.72 15.49,13.08 v15.49,11.43
  Bottom 0.203: U2.12 15.82,11.11 v15.49,11.43 | Q6.5 12.32,13.97 v11.94,13.59
N$13
  Bottom 0.203: U2.13 16.06,11.76 15.49,12.32 15.49,13.84 15.37,13.97 Q6.2
N$14
  Top 0.203: C9.1 22.1,21.21 21.46,20.57 R6.1 20.83,19.94 21.02,19.75 U4.1
N$15  (via drill 0.25)
  Top 0.203: v16.38,9.78 16.26,9.78 15.37,8.89 Q1.5
  Bottom 0.203: U2.10 16.41,9.8 v16.38,9.78
N$16
  Top 0.127: C19.1 49.13,23.74 X1.3 47.75,23.32 47.75,23.24 47.24,22.73 46.86,22.73 46.35,22.23 46.35,20.57 46.32,20.54 U5.20
N$17
  Top 0.127: R23.2 45.47,24.88 45.47,25.02 46.32,25.87 X1.1 46.2,26.16 45.21,26.16 C18.1
N$18
  Top 0.127: U5.21 45.92,20.52 46.1,20.7 46.1,22.23 44.96,23.37
  Top 0.203: 44.96,23.37 R23.1
N$19  (via drill 0.25)
  Route15 0.203: v16,8.13 15.49,8.64 12.06,8.64 v11.94,8.51
  Bottom 0.203: Q5.5 12.32,8.89 v11.94,8.51 | U2.7 20.73,9.8 19.05,8.13 v16,8.13
N$20
  Bottom 0.203: U2.9 16.77,9.15 16.51,8.89 Q5.2
N$21  (via drill 0.25)
  Top 0.203: Q4.2 12.32,24.13 v11.94,24.51
  Route15 0.203: v11.94,24.51 12.06,24.38 15.62,24.38 v16.51,23.5
  Bottom 0.203: v16.51,23.5 16.76,23.24 17.9,23.24 U1.15
N$22
  Bottom 0.203: R27.2 R29.1 38.87,29.21 U9.2
N$23
  Bottom 0.127: R28.2 R30.1 21.34,28.96 21.59,29.21 U10.2
N$24
  Bottom 0.203: Q10.5 12.7,29.21 12.45,29.46 12.45,29.84 | 12.45,29.84 12.45,29.97 | 12.45,29.97 12.45,30.23 | 12.45,30.23 12.7,30.48 13.72,30.48 13.97,30.23 Q10.P1 | Q10.6 12.46,29.86 12.45,29.84 | 12.44,29.96 12.45,29.97 | 12.45,30.23 11.69,30.23 R32.1
N$25
  Top 0.127: 26.92,19.81 R4.2
  Top 0.203: Q9.4 21.07,23.48 21.08,23.5 | 21.59,22.74 R7.2 | 24.51,22.23 26.92,19.81 | R10.1 21.21,26.54 21.21,25.27 TP4.P$1
  Top 0.305: 21.59,23.5 21.59,22.74
  Top 0.406: 21.08,23.5 21.59,23.5 21.72,23.5 TP4.P$1 23.88,24.13 R8.2
  Top 0.813: 24.51,23.88 24.51,22.23 | 24.51,25.65 R8.2 24.51,24.64 24.51,23.88 | 24.51,25.65 22.35,25.65 | 24.51,25.65 26.67,25.65 | 24.51,23.88 26.67,23.88
N$26
  Top 0.203: R7.1 23.37,21.97 23.37,21.47 C9.2 23.88,20.44 23.88,18.54 24.57,17.85 U4.4
N$27
  Top 0.127: U3.9 28.71,14.87 29.34,15.49 C4.1
N$28  (via drill 0.25)
  Top 0.203: Q3.2 12.32,19.05 v11.94,19.43
  Route15 0.203: v11.94,19.43 12.06,19.3 14.73,19.3 v15.49,20.07
  Bottom 0.203: U1.11 17.89,20.57 16,20.57 v15.49,20.07
N$29
  Top 0.127: U5.47 44.72,11.61 R24.1
N$30
  Top 0.127: U5.46 44.32,11.57 R25.1
N$31  (via drill 0.25)
  Top 0.203: Q2.2 12.32,13.97 v11.94,14.35
  Route15 0.203: v16.51,13.08 15.37,14.22 12.06,14.22 v11.94,14.35
  Bottom 0.203: U2.15 16.54,13.05 v16.51,13.08
N$32
  Top 0.203: R10.2 28.2,26.92 J4.P$3
N$33
  Top 0.127: U5.25 44.32,20.58 43.43,21.46 43.43,21.58 R34.1
N$34
  Top 0.127: U5.24 44.72,20.56 43.81,21.46 43.81,22.22 R33.1
N$35
  Top 0.127: 44.2,9.53 44.2,10.19 R25.2
  Top 0.254: J7.2 44.31,7.76 44.2,7.87
  Top 0.508: 44.2,9.53 44.2,7.87
N$37
  Top 0.127: 44.96,9.53 44.96,10.37 R24.2
  Top 0.254: 44.96,7.87 J7.3
  Top 0.508: 44.96,9.53 44.96,7.87
N$39
  Top 0.203: R11.1 C11.1
N$40  (via drill 0.25)
  Top 0.203: R9.1 19.8,8.27
  Top 0.254: 19.8,8.27 v20.45,7.62
  Bottom 0.254: v20.45,7.62 C10.1
N$41
  Top 0.203: R13.1 C12.1
N$42  (via drill 0.25)
  Top 0.203: Q1.2 12.32,8.89 v11.94,9.27
  Route15 0.203: v15.62,10.03 14.73,9.14 12.06,9.14 v11.94,9.27
  Bottom 0.203: U2.11 16.04,10.46 v15.62,10.03
N$43
  Top 0.127: U5.43 43.12,12.77 42.67,12.32
  Top 0.203: R31.2 C40.1 42.67,12.32
N$46
  Top 0.127: R14.1 51.82,20.19 52.07,20.45 LED1.A
N$109
  Top 0.127: R15.1 53.09,19.81 53.09,20.07 53.47,20.45 LED2.A
QSPI_SCLK
  Top 0.127: U6.6 46.1,10.16 45.97,10.29 45.97,10.92 46.72,11.67 U5.52
QSPI_SD0
  Top 0.127: U6.5 46.85,10.66 47.12,10.92 47.12,11.68 47.12,11.69 U5.53
QSPI_SD1
  Top 0.127: U6.2 50.04,9.66 50.29,9.91 50.29,11.43 49.91,11.81 48.39,11.81 47.92,12.28 U5.55
QSPI_SD2
  Top 0.127: U6.3 48.52,10.16 47.75,10.92 47.75,11.43 47.52,11.66 U5.54
QSPI_SD3
  Top 0.127: U6.7 45.97,9.66 45.72,9.91 45.72,11.18 46.32,11.78 U5.51
QSPI_SS_N
  Top 0.127: U6.1 50.18,9.16 50.67,9.65 | 50.67,9.65 50.67,11.68 50.16,12.19 48.64,12.19 48.32,12.51 U5.56 | 50.67,9.65 51.57,9.65 R20.2 R22.1
RUN  (via drill 0.25)
  Top 0.127: U5.26 43.92,20.47 43.18,21.21 41.78,21.21 39.88,23.11 v39.88,23.5 | J5.B7 v55.12,20.95 54.74,20.95 53.85,20.07 R21.1
  Route15 0.127: v39.88,23.5 40.01,23.37 43.43,23.37 43.56,23.5 50.8,23.5 51.44,22.86 53.21,22.86 v55.12,20.95
SPARE0
  Top 0.127: U5.30 40.34,18.71 40.13,18.92 TP5.P$1
SPARE1
  Top 0.127: U5.31 40.41,18.31 40.13,18.03 TP6.P$1
SWCLK  (via drill 0.25)
  Top 0.127: J5.B6 v55.12,22.23 | J6.1 42.15,24.65 42.29,24.51 42.29,24 v42.42,23.88 42.42,23.11 R33.2
  Route15 0.127: v55.12,22.23 53.47,23.88 v42.42,23.88
SWDIO  (via drill 0.25)
  Top 0.127: J5.B5 v55.12,23.5 | R34.2 41.4,22.61 41.4,23.37 v40.89,23.88 40.51,23.88 40.15,24.24 J6.3
  Route15 0.127: v55.12,23.5 54.36,24.26 43.81,24.26 43.69,24.38 41.4,24.38 v40.89,23.88
V1P1  (via drill 0.25)
  Top 0.127: v43.81,12.06 43.81,12.19 43.92,12.3 U5.45 | U5.23 45.12,20.79 v44.96,20.95 44.96,21.59 45.09,21.72 TP12.P$1 | U5.50 45.92,12.01 v45.85,11.94
  Route15 0.406: v43.81,12.06 43.81,13.08 | 43.81,13.08 43.81,19.81 v44.96,20.95 | v45.85,11.94 45.85,12.45 45.21,13.08 43.81,13.08
  Bottom 0.203: C35.1 43.81,13.09 v43.81,12.06 | C34.1 45.85,13.09 v45.85,11.94 | C33.1 44.96,19.8 v44.96,20.95
V3P3  (via drill 0.25)
  Top 0.127: R31.1 v41.66,9.14 | U6.8 47.49,9.16 v47.5,9.14 | R22.2 v53.59,10.41 | U5.33 41.29,17.51 v41.27,17.53 | U5.44 43.52,12.53 43.18,12.19 v43.18,11.81 | U5.42 41.34,13.91 v41.27,13.84 | U5.22 45.52,20.88 v45.59,20.95 | U5.10 49.77,17.51 49.78,17.53 50.16,17.53 v50.29,17.65 | U5.1 50.1,13.91 v50.16,13.84 | U5.48 45.12,12.16 v45.21,12.06 45.52,12.37 U5.49 | R21.2 v54.6,18.55 v54.61,18.54
  Top 0.203: J5.B16 v55.12,9.53 | U3.2 28.71,8.12 v28.83,8 TP8.P$1 | v36.58,10.79 R16.2
  Top 0.254: TP8.P$1 33.91,8 v36.07,10.16
  Route15 0.254: v29.84,20.57 30.73,19.68 35.81,19.68
  Bottom 0.203: C17.1 48.39,9.14 v47.5,9.14 | C41.1 v41.27,17.53 | C37.1 43.18,11.29 v43.18,11.81 | C38.1 49.01,17.65 v50.29,17.65 50.29,16.76 49.91,16.38 C28.1 | C39.1 45.59,19.93 v45.59,20.95 | C43.1 v41.27,13.84 | C36.1 44.96,12.32 v45.21,12.06 | v50.16,13.84 49.52,13.84 C42.1 | C5.1 v28.83,8 | Q10.2 15.49,29.21 19.81,24.89 25.53,24.89 v29.84,20.57
  Bottom 0.254: U8.1 48.51,28.33 | 48.51,28.33 C26.1 | 48.51,28.33 v48.51,27.69 v47.75,27.69
  pour Route15 (isolate 0.203, rank 2, no thermals): 37.85,31.11 57.15,31.11 57.15,5.08 35.81,5.08 35.81,27.43 37.72,29.34 37.72,30.99
V4P0  (via drill 0.25)
  Top 0.203: U3.1 28.21,8.14 v28.07,8 | v25.02,20.57 25.02,19.84 U4.5 | TP10.P$1 v29.97,18.8
  Bottom 0.127: R32.2 11.43,27.69 12.45,26.67 14.99,26.67 15.75,25.91 15.75,24.64 16,24.38 16.51,24.38
  Bottom 0.203: C2.1 18.29,15.24 18.29,15.23 C2.1 | C2.1 C31.1 | U2.16 17.93,14.08 17.91,14.1 v17.91,14.61 17.91,14.85 C2.1 | C1.1 16.51,24.38 17.03,23.86 U1.16 19.29,23.86 19.3,23.88 | C3.1 v28.07,7.99 v28.07,8 | 21.97,20.83 22.18,20.61 U1.6 24.98,20.61 v25.02,20.57 25.27,20.32 25.27,20.07 25.53,19.81 C7.1 26.66,19.8 26.67,19.81
  Bottom 0.305: U9.3 40.1,30.64 39.62,31.11 38.73,31.11 | 38.73,31.11 37.59,31.11 | 37.59,31.11 36.83,31.11 | C29.1 37.59,31.11 | R29.2 38.73,31.11 | 19.3,23.88 20.07,23.88 20.57,23.37 21.08,23.37 21.72,22.73 21.72,21.08 21.97,20.83 | v29.97,18.8 v29.21,18.8 27.69,18.8 26.67,19.81
  Bottom 0.406: 36.83,31.11 36.45,30.73 36.45,24 TP10.P$1 v29.97,18.8
  pour Route15 (isolate 0.203, rank 2): 35.31,19.3 35.31,6.99 17.78,6.99 17.78,15.24 21.84,19.3
VBUS  (via drill 0.25)
  Top 0.254: J7.1 43.66,7.65 v42.93,8.38
  Bottom 0.254: D10.2 52.69,24.53 52.96,24.26 53.72,24.26 53.99,24.53 D10.1
  Bottom 0.406: v42.93,8.38 48.01,8.38 48.26,8.13 55.12,8.13 55.88,8.89 55.88,25.15 55.5,25.53 54.36,25.53 54.1,25.27 54.1,24.82 D10.1
VIN  (via drill 0.25)
  Top 0.254: J5.A3 58.04,26.04 58.67,26.67 58.67,27.94 | J5.B1 54.86,28.57 54.48,28.19 54.48,26.67 55.12,26.04 J5.B3 | J5.A1 58.17,28.57
  Top 0.305: 58.67,27.94 58.17,28.45 58.17,28.57 58.17,29.21 57.91,29.46 54.86,29.46 54.86,28.57 | 52.96,29.46 52.83,29.34 52.83,28.32 52.2,27.69 52.2,26.16 v51.82,25.78
  Top 0.61: F1.2 49.51,30.46 49.78,30.73 51.56,30.73 52.83,29.46 52.96,29.46 54.86,29.46
  Bottom 0.203: D11.1 50.94,24.53 50.55,24.13 50.16,24.13 49.64,24.65 D11.2
  Bottom 0.305: D11.2 49.64,24.78 | D11.1 50.94,25.41 51.31,25.78 v51.82,25.78
VIN_F  (via drill 0.25)
  Top 0.127: C20.P 35.1,28.78 38.35,25.53 R18.2
  Top 0.203: 40,31.23 40.01,31.24
  Top 0.305: 46.61,29.57 F1.1 | C45.1 24.77,30.35 v25.65,31.24 | C44.1 v45.09,31.24
  Top 0.406: C20.P 35.05,31.24
  Top 0.61: v25.65,31.24 v26.42,31.24 35.05,31.24 40.01,31.24 v45.09,31.24 45.97,31.24 46.48,30.73 46.48,29.49 F1.1
  Bottom 0.203: U9.6 43.5,28.26 43.56,28.32 43.56,30.09 43.49,30.16 | C21.1 25.91,29.84 25.4,30.35 | C23.1 44.32,29.97 43.81,30.48
  Bottom 0.305: U9.4 43.49,30.16 43.81,30.48 44.07,30.73 44.07,30.99 v44.32,31.24 v45.09,31.24 | U10.4 25.21,30.16 25.4,30.35 25.65,30.61 v25.65,31.24 v26.42,31.24
VIN_MCU  (via drill 0.25)
  Top 0.203: 53.09,26.67 53.27,26.67 D10.3
  Top 0.305: 53.09,26.67 C22.1 53.85,27.19 v53.85,27.3
  Bottom 0.127: U8.5 53.1,29.83 53.21,29.72 53.21,28.7 53.34,28.57
  Bottom 0.203: D11.3 50.35,26.6 50.42,26.67
  Bottom 0.254: U8.8 53.1,28.33 53.34,28.57 C25.1
  Bottom 0.305: 50.42,26.67 TP7.P$1 53.34,26.67 D10.3 53.85,27.11 v53.85,27.3 C25.1
  other vias: 51.18,26.67
VIN_SENSE  (via drill 0.25)
  Top 0.127: U5.39 41.66,15.11 37.21,15.11 37.08,14.99 v36.58,14.99 35.31,13.72 C16.1 34.92,13.59 34.67,13.59 R19.2 | v36.58,19.56 38.35,21.34 R18.1
  Route15 0.127: v36.58,19.56 v36.58,14.99
VLED  (via drill 0.25)
  Top 0.203: TP11.P$1 8.13,31.37 12.4,31.37 R1.2 | v20.32,31.24 20.32,30.61 19.55,29.83 R12.2
  Top 0.305: C46.1 21.97,30.35 v21.08,31.24
  Top 0.61: R1.2 14.05,29.8 15.49,31.24 v18.54,31.24 v20.32,31.24 v21.08,31.24
  Bottom 0.203: 21.21,30.48 20.7,29.97 R30.2 20.7,30.1 20.45,30.35 19.81,30.35 19.56,30.1 C30.1 | C32.1 v18.54,31.24
  Bottom 0.305: U10.3 21.53,30.16 21.21,30.48 21.08,30.61 v21.08,31.24 v20.32,31.24
VLED_EN  (via drill 0.25)
  Top 0.127: U5.13 50.08,18.71 51.05,19.68 51.05,22.1 v50.29,22.86 | R26.2 20.45,27.56 23.24,27.56 23.37,27.43 v24.64,27.43
  Route15 0.127: v50.29,22.86 50.04,23.11 46.61,23.11 46.48,22.99 38.1,22.99 37.72,23.37 27.69,23.37 24.64,26.42 v24.64,27.43
  Bottom 0.127: U10.6 24.67,27.46 v24.64,27.43
VN1P2  (via drill 0.25)
  Top 0.203: U4.2 v21.21,18.8 | TP9.P$1 v26.29,4.32
  Bottom 0.127: U7.2 28.07,4.45 27.94,4.32 27.94,3.94
  Bottom 0.203: C8.1 v21.21,18.8
  Bottom 0.254: U7.1 28.08,3.79 27.94,3.94 27.31,3.94 | 27.31,3.94 C27.2 | 27.31,3.94 26.67,3.94 v26.29,4.32
  Bottom 0.406: v26.29,4.32 26.29,10.54 26.92,11.18 26.92,15.75 25.91,16.76 23.24,16.76 v21.21,18.8
VN3P0  (via drill 0.25)
  Top 0.203: v37.59,10.67 37.34,10.92 37.34,11.56 37.47,11.68 37.47,12.07 R17.1 | v31.37,3.94 31.87,3.94 C24.2
  Top 0.406: v58.04,5.71 J5.A19
  Bottom 0.127: U7.3 28.18,5.09 28.07,5.21 28.07,5.46 28.32,5.71 28.7,5.71
  Bottom 0.203: 40.51,5.59 40.51,7.75 v37.59,10.67
  Bottom 0.254: U7.6 31.23,3.79 v31.37,3.94 | 32.13,3.94 32.13,4.83 31.24,5.71 29.72,5.71 | 29.72,5.71 28.7,5.71 | U7.PAD 29.72,5.71
  Bottom 0.406: v31.37,3.94 32.13,3.94 38.86,3.94 40.51,5.59 53.34,5.59 54.1,4.83 57.15,4.83 v58.04,5.71
  pour Bottom (isolate 0.203, no thermals): 28.7,6.6 30.99,6.6 30.99,5.71 30.23,5.71 30.23,2.54 29.21,2.54 29.21,5.71 28.7,5.71
VN3P0_SENSE  (via drill 0.25)
  Top 0.127: U5.40 38.08,14.71 v37.59,14.22 R17.2 | R17.2 37.97,13.59 38.22,13.59 C15.1 | R17.2 37.21,13.59 36.97,13.59 R16.1
  Bottom 0.203: v37.59,14.22 38.42,14.22 D9.3

## Text on the board
Bottom: BZ
tPlace: S
bPlace: S | NinjaNIRS 2024 / VCCS Source Interface / v02 05/2024 | BZIM@BU.EDU
tNames: SWD | Vled | Vin | 1.1V | 4.0V | 3.3V | GND | LED / COM | -1.2V | BOOTSEL
bNames: GND | LED Sel / Debug | DUM | ENn | AD3 | AD2 | GND | DAC SPI / Debug | CSn | SCLK | MOSI | LDACn | GND